# EAGLE design Hbridge_new (EAGLE 9.6.0)
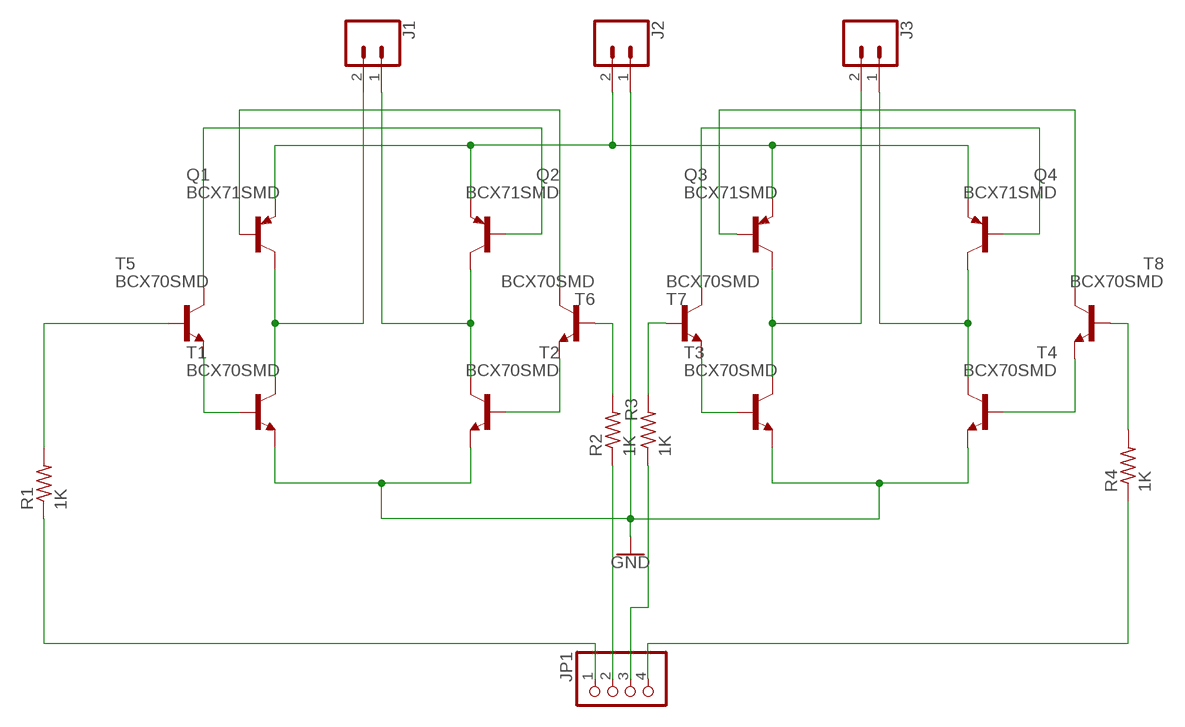
[diagram p0: schematic, sheet 1]

## Parts
J1  CONN_02-JST-2MM-SMT  [JST-2-SMD]
J2  CONN_02-JST-2MM-SMT  [JST-2-SMD]
J3  CONN_02-JST-2MM-SMT  [JST-2-SMD]
JP1  PINHD-1X4  [1X04]
Q1  BCX71SMD  [SOT23]
Q2  BCX71SMD  [SOT23]
Q3  BCX71SMD  [SOT23]
Q4  BCX71SMD  [SOT23]
R1  1K  R-US_M0805  [M0805]
R2  1K  R-US_M0805  [M0805]
R3  1K  R-US_M0805  [M0805]
R4  1K  R-US_M0805  [M0805]
T1  BCX70SMD  [SOT23]
T2  BCX70SMD  [SOT23]
T3  BCX70SMD  [SOT23]
T4  BCX70SMD  [SOT23]
T5  BCX70SMD  [SOT23]
T6  BCX70SMD  [SOT23]
T7  BCX70SMD  [SOT23]
T8  BCX70SMD  [SOT23]

## Nets
GND: J2.1 T1.2(E) T2.2(E) T3.2(E) T4.2(E)
N$1: Q2.1(B) T5.3(C)
N$2: J1.1 Q2.3(C) T2.3(C)
N$3: Q1.1(B) T6.3(C)
N$4: J1.2 Q1.3(C) T1.3(C)
N$5: JP1.1 R1.1
N$6: JP1.2 R2.1
N$7: T1.1(B) T5.2(E)
N$8: T2.1(B) T6.2(E)
N$9: J2.2 Q1.2(E) Q2.2(E) Q3.2(E) Q4.2(E)
N$10: J3.1 Q4.3(C) T4.3(C)
N$11: J3.2 Q3.3(C) T3.3(C)
N$12: JP1.3 R3.1
N$13: JP1.4 R4.1
N$14: Q4.1(B) T7.3(C)
N$15: Q3.1(B) T8.3(C)
N$16: T3.1(B) T7.2(E)
N$17: T4.1(B) T8.2(E)
N$18: R1.2 T5.1(B)
N$19: R2.2 T6.1(B)
N$20: R3.2 T7.1(B)
N$21: R4.2 T8.1(B)

## Library data of the parts
J1-J3 = SparkFun-Connectors:CONN_02: Multi connection point. Often used as Generic Header-pin footprint for 0.1 inch spaced/style header connections On any of the 0.1 inch spaced packages, you can populate with these: Break Away Headers - Straight <https://www.sparkfun.com/products/116> (PRT-00116) Break Away Male Headers - Right Angle <https://www.sparkfun.com/products/553> (PRT-00553) Female Headers <https://www.sparkfun.com/products/115> (PRT-00115) Break Away Headers - Machine Pin <https://www.sparkfun.com/products/117> (PRT-00117) Break Away Female Headers - Swiss Machine Pin <https://www.sparkfun.com/products/743> (PRT-00743) For SCREWTERMINALS and SPRING TERMINALS visit here: Screw Terimnals on SparkFun.com <https://www.sparkfun.com/search/results?term=Screw+Terminals> (5mm/3.5mm/2.54mm spacing) This device is also useful as a general connection point to wire up your design to another part of your project. Our various solder wires solder well into these plated through hole pads. Hook-Up Wire - Assortment (Stranded, 22 AWG) <https://www.sparkfun.com/products/11375> (PRT-11375) Hook-Up Wire - Assortment (Solid Core, 22 AWG) <https://www.sparkfun.com/products/11367> (PRT-11367) View the entire wire category on our website here <https://www.sparkfun.com/categories/141> Special notes: Molex polarized connector foot print use with: PRT-08233 with associated crimp pins and housings. 2.54_SCREWTERM for use with PRT-10571. 3.5mm Screw Terminal footprints for PRT-08084 5mm Screw Terminal footprints for use with PRT-08432; PROD_ID: CONN-11443
JP1 = pinhead:PINHD-1X4: PIN HEADER
Q1-Q4 = transistor-pnp:BCX71SMD: PNP Transistor
R1-R4 = rcl:R-US_: RESISTOR, American symbol; SPICEPREFIX: R
T1-T8 = transistor-neu-to92:BCX70SMD: NPN TRANSISTOR

## Board
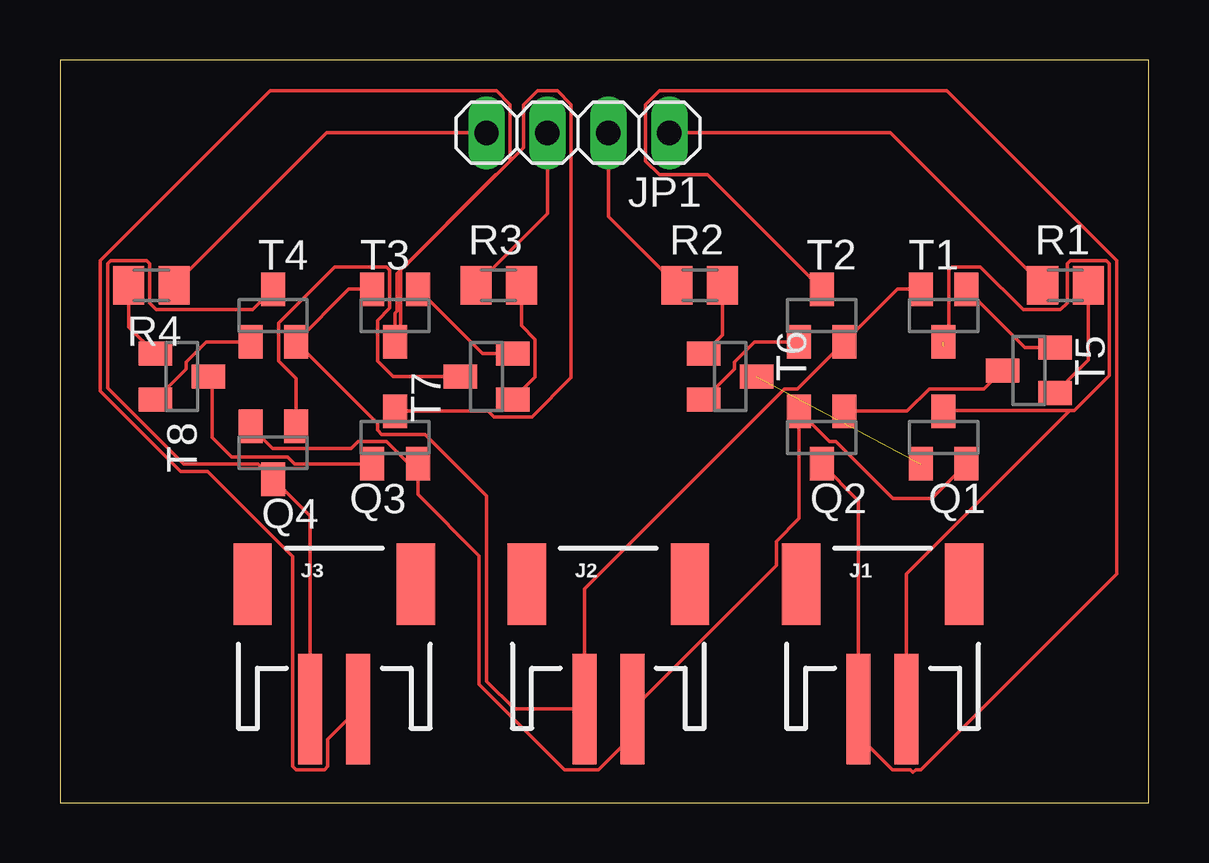
[diagram p1: board, top side]

Size 45.39 x 30.98 mm. Coordinates in mm from the lower left corner, seen from the top.
Outline: 0,0 45.39,0 45.39,30.98 0,30.98 0,0
Copper layers (1*16): Top 0.035mm / dielectric 1.5mm / Bottom 0.035mm
Design rules "default": minimum track width 6mil, minimum drill 0.35mm, track to track 6mil, track to pad 6mil, pad to pad 6mil, via to via 6mil, smd to smd 6mil, copper to edge 40mil, drill to drill 6mil, minimum pad ring 10mil, minimum via ring 8mil, stop-mask expansion 4mil, vias tented up to drill 0mil, thermal gap 10mil

### Footprints (pad centres in the part's own frame; a part is rotated, then mirrored left to right if it is on the bottom)
JST-2-SMD = smd 1 x 4.6: 1 -1,-3.7; 2 1,-3.7 | smd 1.6 x 3.4: NC1 -3.4,1.5; NC2 3.4,1.5
1X04 = drill 1.016 long: 1 -3.81,0; 2 -1.27,0; 3 1.27,0; 4 3.81,0
SOT23 = smd 1 x 1.4: 1 -0.95,-1.1; 2 0.95,-1.1; 3 0,1.1
M0805 = smd 1.3 x 1.6: 1 -0.95,0; 2 0.95,0

### Placement (x,y rotation side)
J1  34.29,7.62 0 top
J2  22.86,7.62 0 top
J3  11.43,7.62 0 top
JP1  21.59,27.94 180 top
Q1  36.83,15.24 0 top
Q2  31.75,15.24 180 top
Q3  13.97,15.24 0 top
Q4  8.89,14.61 180 top
R1  41.91,21.59 0 top
R2  26.67,21.59 0 top
R3  18.29,21.59 0 top
R4  3.81,21.59 180 top
T1  36.83,20.32 180 top
T2  31.75,20.32 0 top
T3  13.97,20.32 180 top
T4  8.89,20.32 0 top
T5  40.39,18.03 90 top
T6  27.94,17.78 270 top
T7  17.78,17.78 90 top
T8  5.08,17.78 270 top

### Tracks (layer width: path | path; a pad name or v marks a point on that pad's centre or on a via)
GND
  Top 0.152: T3.2 12.04,21.42 T4.2 13.24,15.82 13.24,15.54 13.41,15.37 15.21,15.37 17.78,12.8 17.78,5.08 18.94,3.92 J2.1 21.86,8.92 30.2,17.27 30.75,17.27 T2.2 34.9,21.42 T1.2
N$1
  Top 0.152: Q2.1 35.31,16.34 36.23,17.27 38.52,17.27 T5.3
N$2
  Top 0.152: Q2.3 33.29,12.6 J1.1 33.29,2.8 34.7,1.39 35.44,1.39 35.56,1.27 35.68,1.39 35.88,1.39 44.04,9.55 44.04,22.61 36.96,29.69 24.99,29.69 24.41,29.11 24.41,26.77 24.99,26.19 26.98,26.19 T2.3
N$3  (1 unrouted)
N$4  (1 unrouted)
  Top 0.152: J1.2 35.29,9.54 42.1,16.36 | 42.1,16.36 42.28,16.36 43.74,17.81 43.74,22.48 43.6,22.62 42.12,22.62 41.98,22.48 41.98,20.84 41.7,20.56 40.16,20.56 38.38,22.35 37.19,22.35 37.05,22.21 37.05,19.27 36.83,19.05 | Q1.3 36.84,16.36 42.1,16.36
N$5
  Top 0.152: JP1.1 34.61,27.94 R1.1
N$6
  Top 0.152: JP1.2 22.86,24.45 R2.1
N$7
  Top 0.152: T1.1 40.22,18.98 T5.2
N$8
  Top 0.152: T6.2 28.11,18.1 28.11,18.38 28.96,19.22 T2.1
N$9
  Top 0.152: Q4.2 8.87,14.78 12.13,14.78 12.43,15.07 13.62,15.07 14.54,14.14 Q3.2 14.92,12.86 17.48,10.3 17.48,4.95 21.04,1.39 22.45,1.39 23.86,2.8 J2.2 23.88,3.92 29.86,9.9 29.86,10.91 30.8,11.85 Q2.2 32.07,15.07 32.34,15.07 34.71,12.7 36.34,12.7 Q1.2
N$10
  Top 0.152: J3.1 10.43,11.96 Q4.3 8.27,14.13 5.16,14.13 1.98,17.3 1.98,22.48 2.12,22.62 3.6,22.62 3.74,22.48 3.74,20.84 4.01,20.56 8.03,20.56 T4.3
N$11
  Top 0.152: Q3.3 17.85,16.34 18.09,16.1 19.68,16.1 21.31,17.74 21.31,29.11 20.73,29.69 19.91,29.69 19.33,29.11 19.33,27.33 14.35,22.35 14.32,22.35 14.19,22.21 14.19,19.44 T3.3 13.97,20.42 14.05,20.5 14.05,22.08 18.16,26.19 18.19,26.19 18.77,26.77 18.77,29.11 18.19,29.69 8.76,29.69 1.68,22.61 1.68,17.18 5.03,13.82 6.15,13.82 9.7,10.27 9.7,1.52 9.84,1.39 11.03,1.39 11.16,1.52 11.16,2.65 J3.2
N$12
  Top 0.152: JP1.3 20.32,24.57 R3.1
N$13
  Top 0.152: R4.1 11.11,27.94 JP1.4
N$14
  Top 0.152: Q4.1 9.84,17.7 9.11,18.43 9.11,20.02 11.45,22.35 13.62,22.35 13.75,22.21 13.75,20.62 13.24,20.12 13.24,18.43 13.89,17.78 T7.3
N$15
  Top 0.152: Q3.1 9.78,14.14 9.48,14.43 7.16,14.43 6.35,15.24 6.35,17.61 T8.3
N$16
  Top 0.152: T3.1 17.61,18.73 T7.2
N$17
  Top 0.152: T8.2 5.25,18.1 5.25,18.38 6.1,19.22 T4.1
N$18
  Top 0.152: R1.2 42.86,18.46 T5.1
N$19
  Top 0.152: R2.2 27.62,19.51 T6.1
N$20
  Top 0.152: R3.2 19.24,19.89 19.81,19.32 19.81,17.76 T7.1
N$21
  Top 0.152: R4.2 2.86,19.85 T8.1